# Altium schematic sheet H27U1G8F2BTR-BC.SchDoc
size A4
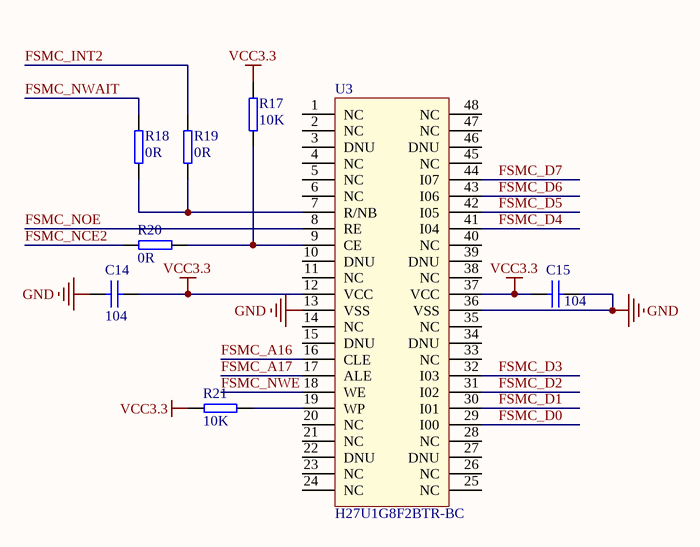
[diagram p0: H27U1G8F2BTR-BC.SchDoc]

## Parts
C14  104  [0805C]
C15  104  [0805C]
R17  10K  [2512R]
R18  0R  [2512R]
R19  0R  [2512R]
R20  0R  [2512R]
R21  10K  [2512R]
U3  H27U1G8F2BTR-BC  [TSOP48]

## Nets
GND: C14.1 C15.2 U3.13(VSS) U3.36(VSS)
VCC3.3: C14.2 C15.1 R17.2 R21.1 U3.12(VCC) U3.37(VCC)
FSMC_A16: U3.16(CLE)
FSMC_A17: U3.17(ALE)
FSMC_D0: U3.29(I00)
FSMC_D1: U3.30(I01)
FSMC_D2: U3.31(I02)
FSMC_D3: U3.32(I03)
FSMC_D4: U3.41(I04)
FSMC_D5: U3.42(I05)
FSMC_D6: U3.43(I06)
FSMC_D7: U3.44(I07)
FSMC_INT2: R19.2
FSMC_NCE2: R20.1
FSMC_NOE: U3.8(RE)
FSMC_NWAIT: R18.2
FSMC_NWE: U3.18(WE)
NetR17_1: R17.1 R20.2 U3.9(CE)
NetR18_1: R18.1 R19.1 U3.7(R/NB)
NetR21_2: R21.2 U3.19(WP)

Not connected (* = marked no-connect by the designer): U3 1(NC) 2(NC) 3(DNU) 4(NC) 5(NC) 6(NC) 10(DNU) 11(NC) 14(NC) 15(DNU) 20(NC) 21(NC) 22(DNU) 23(NC) 24(NC) 25(NC) 26(NC) 27(DNU) 28(NC) 33(NC) 34(DNU) 35(NC) 38(NC) 39(DNU) 40(NC) 45(NC) 46(DNU) 47(NC) 48(NC)

## Library data of the parts
C14 C15 = Cap: 贴片电容
R17-R21 = RES-10K
U3 = H27U1G8F2BTR-BC: 128M字节Nand Flash